# EAGLE schematic nonregulation-level-shifter-mk-2.4 (EAGLE 7.5.0)
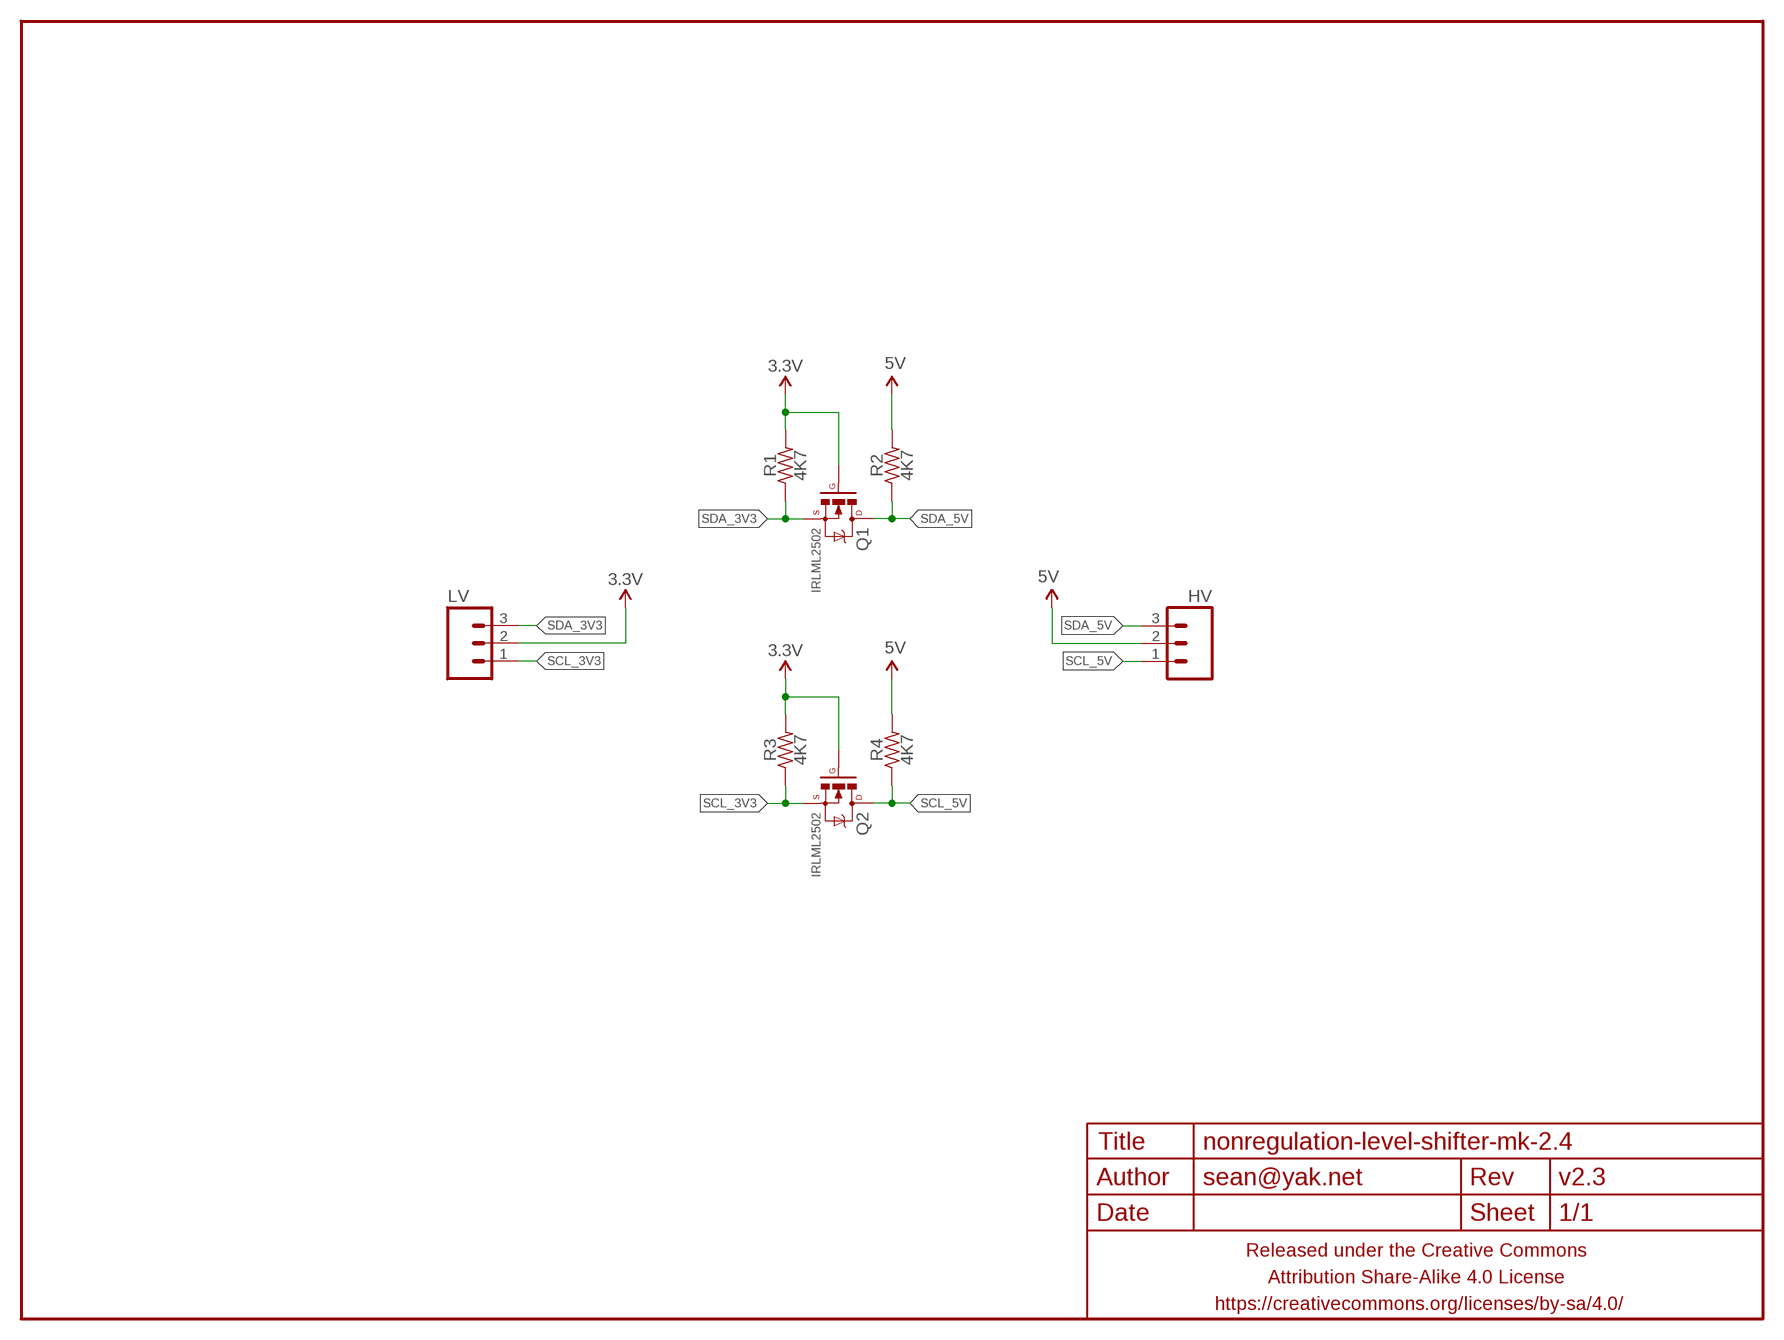
[diagram p0: schematic, sheet 1]

## Parts
FRAME1  FRAME-LETTERNO_PACKAGE  [DUMMY]
HV  M03PTH-CENTERED  [1X03-CENTERED]
LV  M03PTH-CENTERED  [1X03-CENTERED]
Q1  IRLML2502  MOSFET-NCHANNELIRLML2502  [SOT23]
Q2  IRLML2502  MOSFET-NCHANNELIRLML2502  [SOT23]
R1  4K7  RESISTORR0603-TIGHTER  [R0603-TIGHTER]
R2  4K7  RESISTORR0603-TIGHTER  [R0603-TIGHTER]
R3  4K7  RESISTORR0603  [R0603]
R4  4K7  RESISTORR0603-TIGHTER  [R0603-TIGHTER]

## Nets
3.3V: LV.2 Q1.1(G) Q2.1(G) R1.2 R3.2
5V: HV.2 R2.2 R4.2
SCL_3V3: LV.1 Q2.2(S) R3.1
SCL_5V: HV.1 Q2.3(D) R4.1
SDA_3V3: LV.3 Q1.2(S) R1.1
SDA_5V: HV.3 Q1.3(D) R2.1

## Library data of the parts
FRAME1 = A_butts:FRAME-LETTER: Schematic Frame Standard 8.5x11 US Letter frame; DESIGNER: sean@yak.net; VERSION: v2.3
HV LV = a_parts:M03: Header 3 Standard 3-pin 0.1" header. Use with straight break away headers (SKU : PRT-00116), right angle break away headers (PRT-00553), swiss pins (PRT-00743), machine pins (PRT-00117), and female headers (PRT-00115). Molex polarized connector foot print use with SKU : PRT-08232 with associated crimp pins and housings.
Q1 Q2 = a_parts:MOSFET-NCHANNEL: Common NMOSFET Parts MFG P/N Store ID Prod ID FDD8780 TRANS-09984 SI7820DN TRANS-11055 FDS6630A IC-08089 2N7002PW TRANS-11151 FQP30N06L COM-10213 TRANS-10060 BSS123LT1G TRANS-08345 BSS138 TRANS-00830 BS170 2N7000
R1-R4 = a_parts:RESISTOR: RESISTOR, American symbol